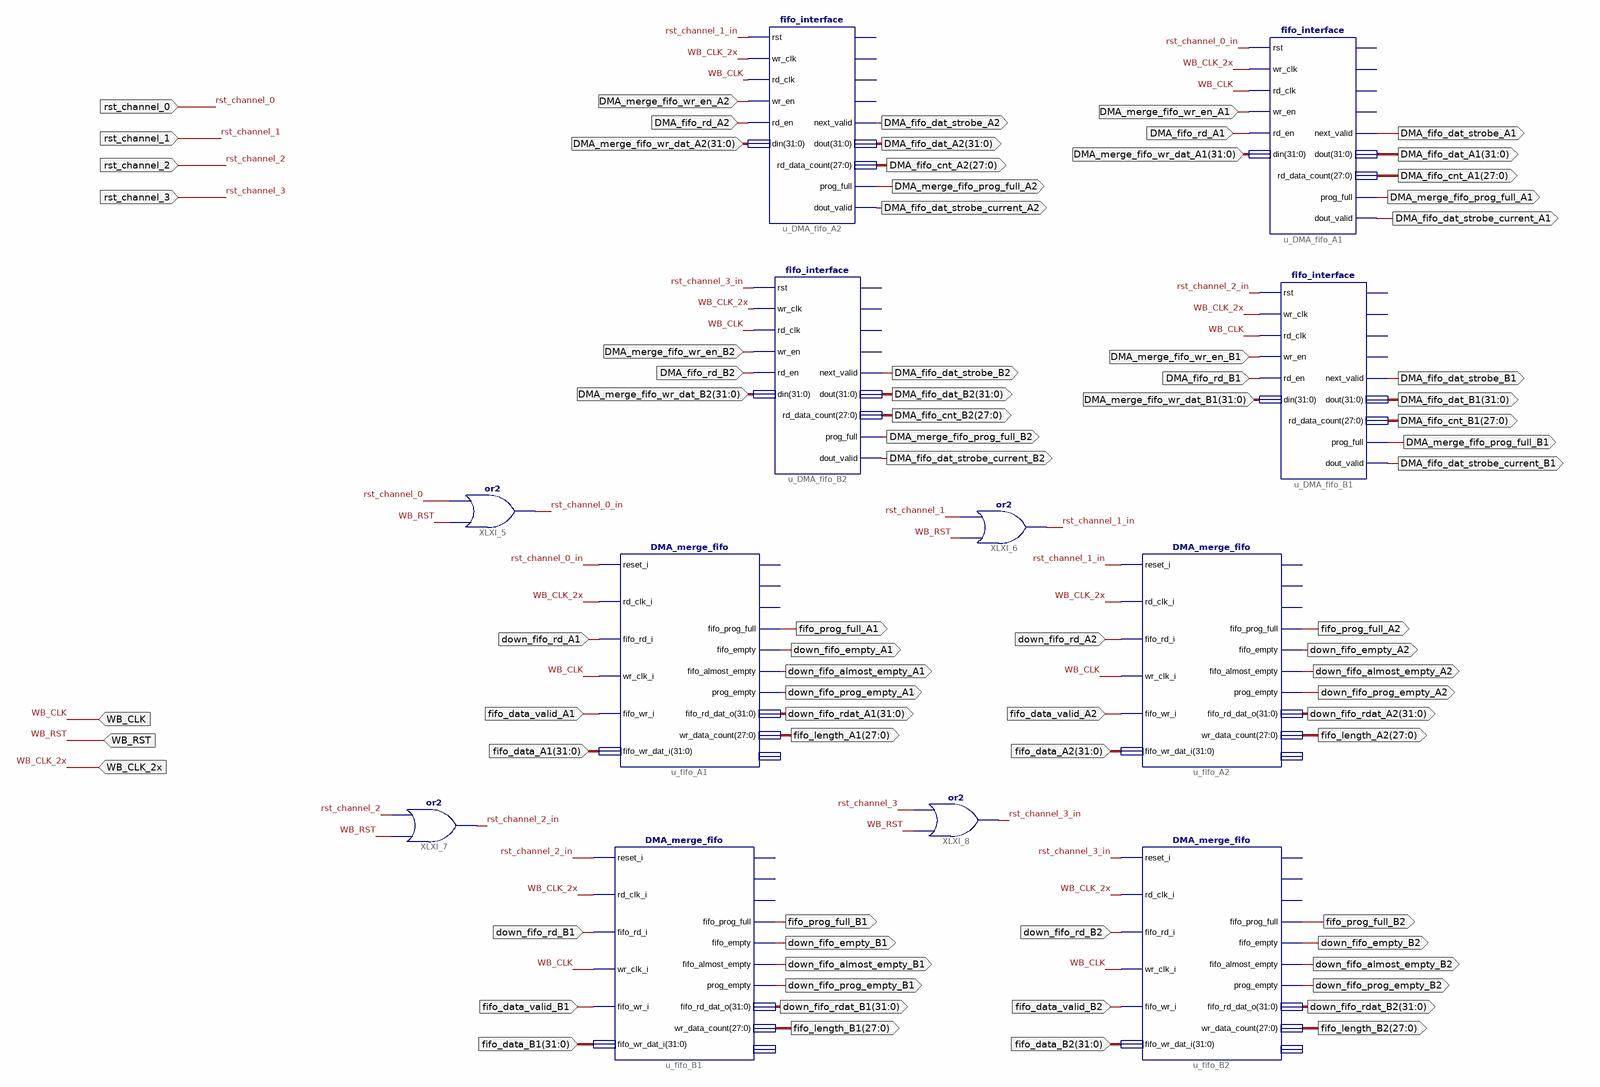
[diagram p0: schematic sheet 1]
// Xilinx ISE schematic DMA_FIFOs.sch (spartan6) as structural Verilog: 12 symbols, 75 ports
module DMA_FIFOs (
  input  WB_CLK,
  input  WB_RST,
  input  WB_CLK_2x,
  input  fifo_data_valid_A1,
  input  [31:0] fifo_data_A1,
  input  down_fifo_rd_A1,
  input  fifo_data_valid_B1,
  input  [31:0] fifo_data_B1,
  input  down_fifo_rd_B1,
  input  fifo_data_valid_A2,
  input  [31:0] fifo_data_A2,
  input  down_fifo_rd_A2,
  input  fifo_data_valid_B2,
  input  [31:0] fifo_data_B2,
  input  down_fifo_rd_B2,
  input  DMA_fifo_rd_A2,
  input  DMA_fifo_rd_B2,
  input  DMA_merge_fifo_wr_en_A2,
  input  DMA_merge_fifo_wr_en_B2,
  input  [31:0] DMA_merge_fifo_wr_dat_A2,
  input  DMA_fifo_rd_B1,
  input  DMA_merge_fifo_wr_en_B1,
  input  [31:0] DMA_merge_fifo_wr_dat_B1,
  input  DMA_fifo_rd_A1,
  input  DMA_merge_fifo_wr_en_A1,
  input  [31:0] DMA_merge_fifo_wr_dat_A1,
  input  [31:0] DMA_merge_fifo_wr_dat_B2,
  input  rst_channel_0,
  input  rst_channel_1,
  input  rst_channel_2,
  input  rst_channel_3,
  output fifo_prog_full_A1,
  output [27:0] fifo_length_A1,
  output down_fifo_empty_A1,
  output [31:0] down_fifo_rdat_A1,
  output fifo_prog_full_B1,
  output [27:0] fifo_length_B1,
  output down_fifo_empty_B1,
  output [31:0] down_fifo_rdat_B1,
  output down_fifo_almost_empty_A1,
  output down_fifo_prog_empty_A1,
  output fifo_prog_full_A2,
  output [27:0] fifo_length_A2,
  output down_fifo_empty_A2,
  output [31:0] down_fifo_rdat_A2,
  output fifo_prog_full_B2,
  output [27:0] fifo_length_B2,
  output down_fifo_empty_B2,
  output [31:0] down_fifo_rdat_B2,
  output down_fifo_almost_empty_A2,
  output down_fifo_prog_empty_A2,
  output down_fifo_almost_empty_B2,
  output down_fifo_prog_empty_B2,
  output down_fifo_almost_empty_B1,
  output down_fifo_prog_empty_B1,
  output DMA_fifo_dat_strobe_A2,
  output [31:0] DMA_fifo_dat_A2,
  output [27:0] DMA_fifo_cnt_A2,
  output DMA_fifo_dat_strobe_current_A2,
  output DMA_fifo_dat_strobe_B2,
  output [31:0] DMA_fifo_dat_B2,
  output [27:0] DMA_fifo_cnt_B2,
  output DMA_fifo_dat_strobe_current_B2,
  output DMA_merge_fifo_prog_full_A2,
  output DMA_merge_fifo_prog_full_B2,
  output DMA_fifo_dat_strobe_B1,
  output [31:0] DMA_fifo_dat_B1,
  output [27:0] DMA_fifo_cnt_B1,
  output DMA_fifo_dat_strobe_current_B1,
  output DMA_merge_fifo_prog_full_B1,
  output DMA_fifo_dat_strobe_current_A1,
  output [31:0] DMA_fifo_dat_A1,
  output DMA_fifo_dat_strobe_A1,
  output [27:0] DMA_fifo_cnt_A1,
  output DMA_merge_fifo_prog_full_A1
);

  wire rst_channel_0_in, rst_channel_1_in, rst_channel_2_in, rst_channel_3_in;

  DMA_merge_fifo u_fifo_A1 (
    .reset_i(rst_channel_0_in), .rd_clk_i(WB_CLK_2x), .fifo_rd_i(down_fifo_rd_A1), .wr_clk_i(WB_CLK),
    .fifo_wr_i(fifo_data_valid_A1), .fifo_wr_dat_i(fifo_data_A1), .fifo_prog_full(fifo_prog_full_A1),
    .fifo_empty(down_fifo_empty_A1), .fifo_almost_empty(down_fifo_almost_empty_A1),
    .prog_empty(down_fifo_prog_empty_A1), .fifo_rd_dat_o(down_fifo_rdat_A1), .wr_data_count(fifo_length_A1));  // open: fifo_rd_dat_valid_o, fifo_full, fifo_almost_full, rd_data_count
  DMA_merge_fifo u_fifo_B1 (
    .reset_i(rst_channel_2_in), .rd_clk_i(WB_CLK_2x), .fifo_rd_i(down_fifo_rd_B1), .wr_clk_i(WB_CLK),
    .fifo_wr_i(fifo_data_valid_B1), .fifo_wr_dat_i(fifo_data_B1), .fifo_prog_full(fifo_prog_full_B1),
    .fifo_empty(down_fifo_empty_B1), .fifo_almost_empty(down_fifo_almost_empty_B1),
    .prog_empty(down_fifo_prog_empty_B1), .fifo_rd_dat_o(down_fifo_rdat_B1), .wr_data_count(fifo_length_B1));  // open: fifo_rd_dat_valid_o, fifo_full, fifo_almost_full, rd_data_count
  DMA_merge_fifo u_fifo_A2 (
    .reset_i(rst_channel_1_in), .rd_clk_i(WB_CLK_2x), .fifo_rd_i(down_fifo_rd_A2), .wr_clk_i(WB_CLK),
    .fifo_wr_i(fifo_data_valid_A2), .fifo_wr_dat_i(fifo_data_A2), .fifo_prog_full(fifo_prog_full_A2),
    .fifo_empty(down_fifo_empty_A2), .fifo_almost_empty(down_fifo_almost_empty_A2),
    .prog_empty(down_fifo_prog_empty_A2), .fifo_rd_dat_o(down_fifo_rdat_A2), .wr_data_count(fifo_length_A2));  // open: fifo_rd_dat_valid_o, fifo_full, fifo_almost_full, rd_data_count
  DMA_merge_fifo u_fifo_B2 (
    .reset_i(rst_channel_3_in), .rd_clk_i(WB_CLK_2x), .fifo_rd_i(down_fifo_rd_B2), .wr_clk_i(WB_CLK),
    .fifo_wr_i(fifo_data_valid_B2), .fifo_wr_dat_i(fifo_data_B2), .fifo_prog_full(fifo_prog_full_B2),
    .fifo_empty(down_fifo_empty_B2), .fifo_almost_empty(down_fifo_almost_empty_B2),
    .prog_empty(down_fifo_prog_empty_B2), .fifo_rd_dat_o(down_fifo_rdat_B2), .wr_data_count(fifo_length_B2));  // open: fifo_rd_dat_valid_o, fifo_full, fifo_almost_full, rd_data_count
  fifo_interface u_DMA_fifo_A2 (
    .wr_clk(WB_CLK_2x), .rd_clk(WB_CLK), .wr_en(DMA_merge_fifo_wr_en_A2), .rd_en(DMA_fifo_rd_A2),
    .din(DMA_merge_fifo_wr_dat_A2), .next_valid(DMA_fifo_dat_strobe_A2), .dout(DMA_fifo_dat_A2),
    .rd_data_count(DMA_fifo_cnt_A2), .prog_full(DMA_merge_fifo_prog_full_A2), .rst(rst_channel_1_in),
    .dout_valid(DMA_fifo_dat_strobe_current_A2));  // open: full, almost_full, empty, almost_empty
  fifo_interface u_DMA_fifo_B2 (
    .wr_clk(WB_CLK_2x), .rd_clk(WB_CLK), .wr_en(DMA_merge_fifo_wr_en_B2), .rd_en(DMA_fifo_rd_B2),
    .din(DMA_merge_fifo_wr_dat_B2), .next_valid(DMA_fifo_dat_strobe_B2), .dout(DMA_fifo_dat_B2),
    .rd_data_count(DMA_fifo_cnt_B2), .prog_full(DMA_merge_fifo_prog_full_B2), .rst(rst_channel_3_in),
    .dout_valid(DMA_fifo_dat_strobe_current_B2));  // open: full, almost_full, empty, almost_empty
  fifo_interface u_DMA_fifo_B1 (
    .wr_clk(WB_CLK_2x), .rd_clk(WB_CLK), .wr_en(DMA_merge_fifo_wr_en_B1), .rd_en(DMA_fifo_rd_B1),
    .din(DMA_merge_fifo_wr_dat_B1), .next_valid(DMA_fifo_dat_strobe_B1), .dout(DMA_fifo_dat_B1),
    .rd_data_count(DMA_fifo_cnt_B1), .prog_full(DMA_merge_fifo_prog_full_B1), .rst(rst_channel_2_in),
    .dout_valid(DMA_fifo_dat_strobe_current_B1));  // open: full, almost_full, empty, almost_empty
  fifo_interface u_DMA_fifo_A1 (
    .wr_clk(WB_CLK_2x), .rd_clk(WB_CLK), .wr_en(DMA_merge_fifo_wr_en_A1), .rd_en(DMA_fifo_rd_A1),
    .din(DMA_merge_fifo_wr_dat_A1), .next_valid(DMA_fifo_dat_strobe_A1), .dout(DMA_fifo_dat_A1),
    .rd_data_count(DMA_fifo_cnt_A1), .prog_full(DMA_merge_fifo_prog_full_A1), .rst(rst_channel_0_in),
    .dout_valid(DMA_fifo_dat_strobe_current_A1));  // open: full, almost_full, empty, almost_empty
  or XLXI_6 (rst_channel_1_in, WB_RST, rst_channel_1);
  or XLXI_7 (rst_channel_2_in, WB_RST, rst_channel_2);
  or XLXI_8 (rst_channel_3_in, WB_RST, rst_channel_3);
  or XLXI_5 (rst_channel_0_in, WB_RST, rst_channel_0);
endmodule
